# EAGLE schematic ce3_redraw (EAGLE 8.5.1)
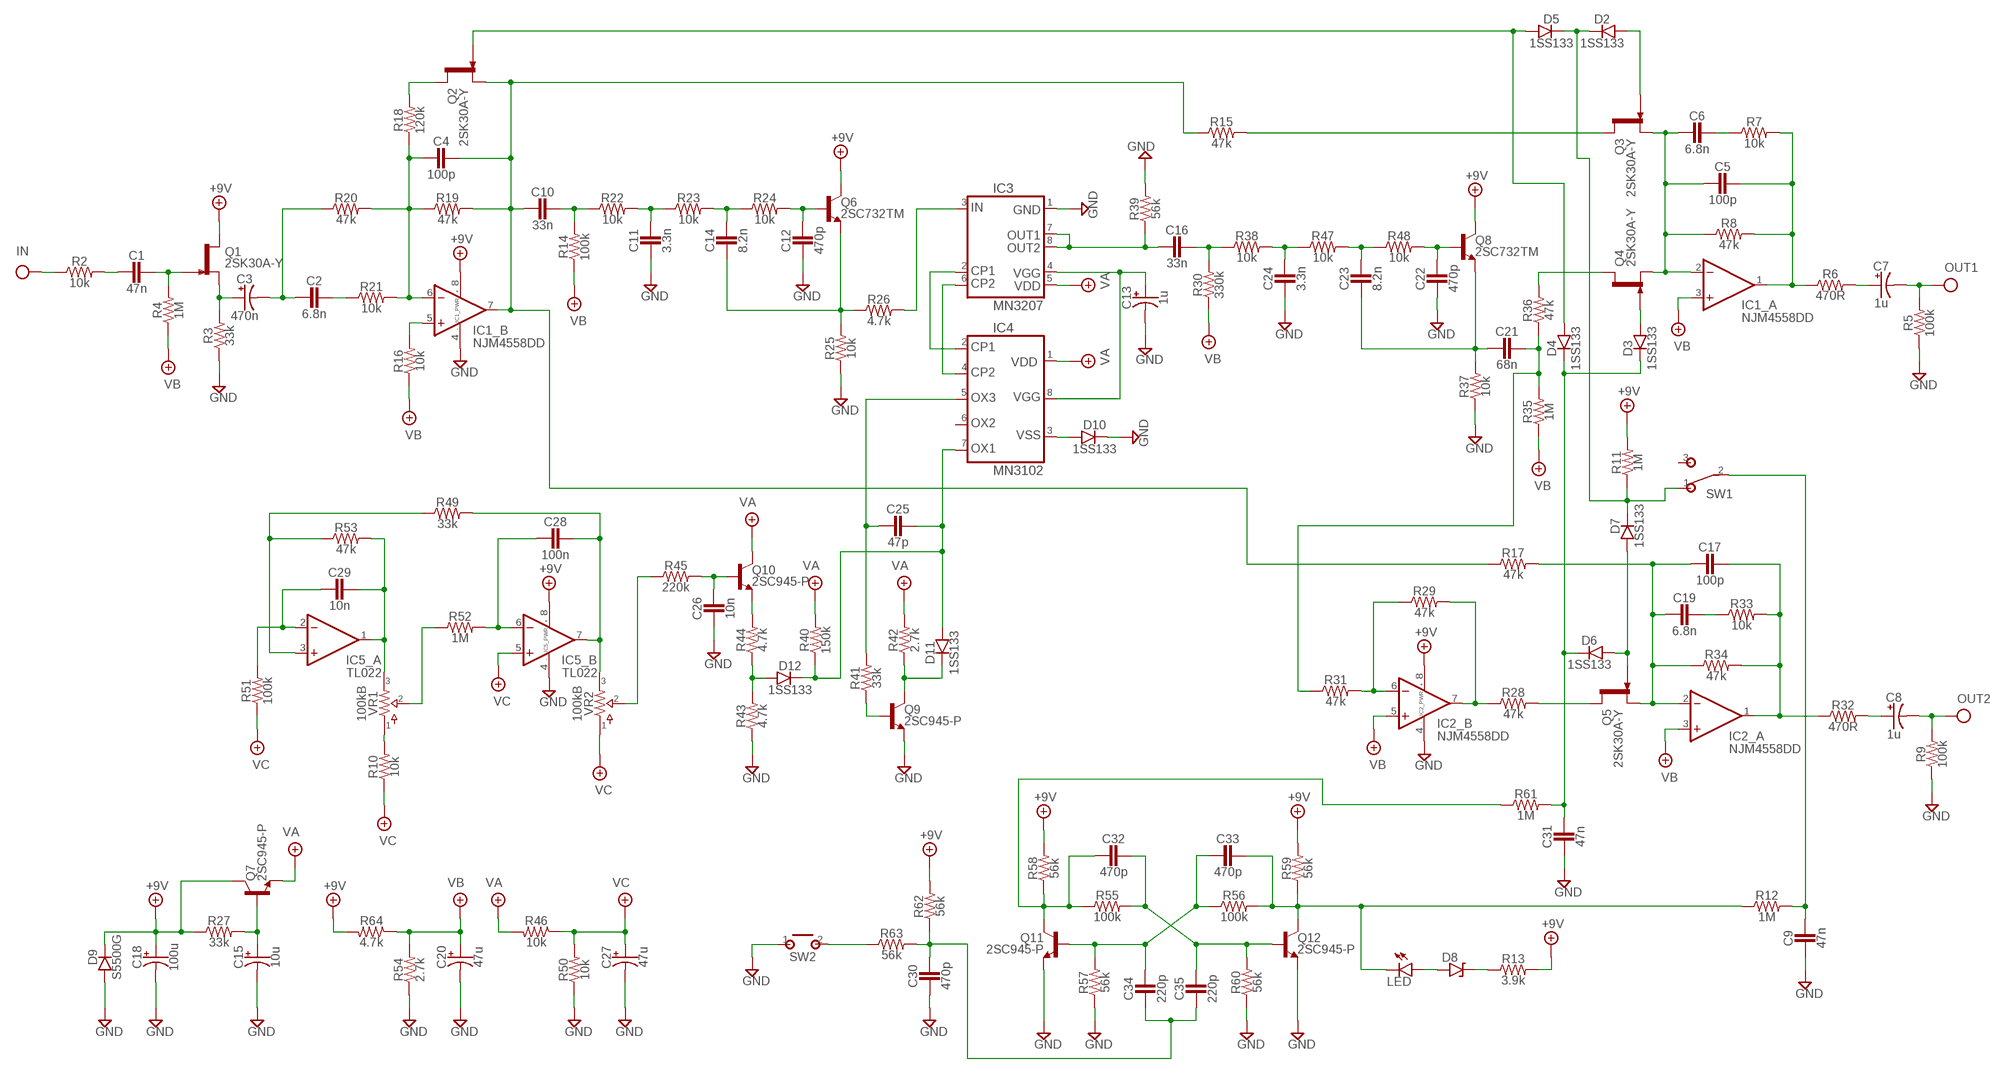
[diagram p0: schematic, sheet 1]

## Parts
C1  47n  CER/FILMBOX.1  [BOX_SMALL]
C2  6.8n  CER/FILMBOX.1  [BOX_SMALL]
C3  470n  0400  [040_020]
C4  100p  CER/FILMBOX.1  [BOX_SMALL]
C5  100p  CER/FILMBOX.1  [BOX_SMALL]
C6  6.8n  CER/FILMBOX.1  [BOX_SMALL]
C7  1u  0400  [040_020]
C8  1u  0400  [040_020]
C9  47n  CER/FILMBOX.1  [BOX_SMALL]
C10  33n  CER/FILMBOX.1  [BOX_SMALL]
C11  3.3n  CER/FILMBOX.1  [BOX_SMALL]
C12  470p  CER/FILMBOX.1  [BOX_SMALL]
C13  1u  0400  [040_020]
C14  8.2n  CER/FILMBOX.1  [BOX_SMALL]
C15  10u  0400  [040_020]
C16  33n  CER/FILMBOX.1  [BOX_SMALL]
C17  100p  CER/FILMBOX.1  [BOX_SMALL]
C18  100u  0400  [040_020]
C19  6.8n  CER/FILMBOX.1  [BOX_SMALL]
C20  47u  0400  [040_020]
C21  68n  CER/FILMBOX.1  [BOX_SMALL]
C22  470p  CER/FILMBOX.1  [BOX_SMALL]
C23  8.2n  CER/FILMBOX.1  [BOX_SMALL]
C24  3.3n  CER/FILMBOX.1  [BOX_SMALL]
C25  47p  CER/FILMBOX.1  [BOX_SMALL]
C26  10n  CER/FILMBOX.1  [BOX_SMALL]
C27  47u  0400  [040_020]
C28  100n  CER/FILMBOX.1  [BOX_SMALL]
C29  10n  CER/FILMBOX.1  [BOX_SMALL]
C30  470p  CER/FILMBOX.1  [BOX_SMALL]
C31  47n  CER/FILMBOX.1  [BOX_SMALL]
C32  470p  CER/FILMBOX.1  [BOX_SMALL]
C33  470p  CER/FILMBOX.1  [BOX_SMALL]
C34  220p  CER/FILMBOX.1  [BOX_SMALL]
C35  220p  CER/FILMBOX.1  [BOX_SMALL]
D2  1SS133  DO35.2  [DO35-2]
D3  1SS133  DO35.2  [DO35-2]
D4  1SS133  DO35.2  [DO35-2]
D5  1SS133  DO35.2  [DO35-2]
D6  1SS133  DO35.2  [DO35-2]
D7  1SS133  DO35.2  [DO35-2]
D8  ZENER.2  [DO41-2]
D9  S5500G  DO35.2  [DO35-2]
D10  1SS133  DO35.2  [DO35-2]
D11  1SS133  DO35.2  [DO35-2]
D12  1SS133  DO35.2  [DO35-2]
IC1  NJM4558DD  DUALTH  [DIL0]
IC2  NJM4558DD  DUALTH  [DIL0]
IC3  MN3207  BL3208  [DIL0]
IC4  MN3102  CLOCK  [DIL8]
IC5  TL022  DUALTH  [DIL0]
LED  LED  [3MM_D]
Q1  2SK30A-Y  2N5457  [TO92-]
Q2  2SK30A-Y  2N5457  [TO92-]
Q3  2SK30A-Y  2N5457  [TO92-]
Q4  2SK30A-Y  2N5457  [TO92-]
Q5  2SK30A-Y  2N5457  [TO92-]
Q6  2SC732TM  2SC828A  [TO92-]
Q7  2SC945-P  2SC828A  [TO92-]
Q8  2SC732TM  2SC828A  [TO92-]
Q9  2SC945-P  2SC828A  [TO92-]
Q10  2SC945-P  2SC828A  [TO92-]
Q11  2SC945-P  2SC828A  [TO92-]
Q12  2SC945-P  2SC828A  [TO92-]
R2  10k  R_.3B  [R0207/3]
R3  33k  R_.3B  [R0207/3]
R4  1M  R_.3B  [R0207/3]
R5  100k  R_.3B  [R0207/3]
R6  470R  R_.3B  [R0207/3]
R7  10k  R_.3B  [R0207/3]
R8  47k  R_.3B  [R0207/3]
R9  100k  R_.3B  [R0207/3]
R10  10k  R_.3B  [R0207/3]
R11  1M  R_.3B  [R0207/3]
R12  1M  R_.3B  [R0207/3]
R13  3.9k  R_.3B  [R0207/3]
R14  100k  R_.3B  [R0207/3]
R15  47k  R_.3B  [R0207/3]
R16  10k  R_.3B  [R0207/3]
R17  47k  R_.3B  [R0207/3]
R18  120k  R_.3B  [R0207/3]
R19  47k  R_.3B  [R0207/3]
R20  47k  R_.3B  [R0207/3]
R21  10k  R_.3B  [R0207/3]
R22  10k  R_.3B  [R0207/3]
R23  10k  R_.3B  [R0207/3]
R24  10k  R_.3B  [R0207/3]
R25  10k  R_.3B  [R0207/3]
R26  4.7k  R_.3B  [R0207/3]
R27  33k  R_.3B  [R0207/3]
R28  47k  R_.3B  [R0207/3]
R29  47k  R_.3B  [R0207/3]
R30  330k  R_.3B  [R0207/3]
R31  47k  R_.3B  [R0207/3]
R32  470R  R_.3B  [R0207/3]
R33  10k  R_.3B  [R0207/3]
R34  47k  R_.3B  [R0207/3]
R35  1M  R_.3B  [R0207/3]
R36  47k  R_.3B  [R0207/3]
R37  10k  R_.3B  [R0207/3]
R38  10k  R_.3B  [R0207/3]
R39  56k  R_.3B  [R0207/3]
R40  150k  R_.3B  [R0207/3]
R41  33k  R_.3B  [R0207/3]
R42  2.7k  R_.3B  [R0207/3]
R43  4.7k  R_.3B  [R0207/3]
R44  4.7k  R_.3B  [R0207/3]
R45  220k  R_.3B  [R0207/3]
R46  10k  R_.3B  [R0207/3]
R47  10k  R_.3B  [R0207/3]
R48  10k  R_.3B  [R0207/3]
R49  33k  R_.3B  [R0207/3]
R50  10k  R_.3B  [R0207/3]
R51  100k  R_.3B  [R0207/3]
R52  1M  R_.3B  [R0207/3]
R53  47k  R_.3B  [R0207/3]
R54  2.7k  R_.3B  [R0207/3]
R55  100k  R_.3B  [R0207/3]
R56  100k  R_.3B  [R0207/3]
R57  56k  R_.3B  [R0207/3]
R58  56k  R_.3B  [R0207/3]
R59  56k  R_.3B  [R0207/3]
R60  56k  R_.3B  [R0207/3]
R61  1M  R_.3B  [R0207/3]
R62  56k  R_.3B  [R0207/3]
R63  56k  R_.3B  [R0207/3]
R64  4.7k  R_.3B  [R0207/3]
SW1  SPDT  [M9040P]
SW2  MOMENTARY  [SPST]
VR1  100kB  POTS16MM  [16MM]
VR2  100kB  POTS16MM  [16MM]

## Nets
+9V: C18.+ D9.C IC1.8(_PWR:V+) IC2.8(_PWR:V+) IC5.8(_PWR:V+) Q1.3(D) Q6.2(C) Q7.2(C) Q8.2(C) R11.2 R13.2 R27.1 R58.2 R59.2 R62.2 R64.2
GND: C9.2 C11.2 C12.2 C13.- C15.- C18.- C20.- C22.2 C24.2 C26.2 C27.- C30.2 C31.2 D9.A D10.C IC1.4(_PWR:V-) IC2.4(_PWR:V-) IC3.1 IC5.4(_PWR:V-) Q9.3(E) Q11.3(E) Q12.3(E) R3.1 R5.1 R9.1 R25.1 R37.1 R39.2 R43.1 R50.1 R54.1 R57.1 R60.1 SW2.1(P)
IN: R2.1
N$1: C15.+ Q7.1(B) R27.2
N$3: C1.2 R2.2
N$4: C1.1 Q1.1(G) R4.2
N$5: C2.2 C3.- R20.1
N$7: C3.+ Q1.2(S) R3.2
N$8: C2.1 R21.1
N$9: C4.2 IC1.6(_B:-IN) R18.1 R19.1 R20.2 R21.2
N$10: IC1.5(_B:+IN) R16.2
N$11: C10.1 R14.2 R22.1
N$12: C4.1 C10.2 IC1.7(_B:OUT) Q2.2(S) R15.1 R17.1 R19.2
N$13: Q2.3(D) R18.2
N$14: C11.1 R22.2 R23.1
N$15: C14.1 R23.2 R24.1
N$16: C14.2 Q6.3(E) R25.2 R26.1
N$17: C12.1 Q6.1(B) R24.2
N$18: C13.+ IC3.4 IC4.8
N$19: D11.C Q9.2(C) R42.1
N$20: D10.A IC4.3
N$21: C25.2 IC4.5 R41.2
N$22: Q9.1(B) R41.1
N$23: C16.2 IC3.7 IC3.8 R39.1
N$24: D12.A R43.2 R44.1
N$25: IC3.3 R26.2
N$26: IC3.2 IC4.2
N$29: C32.2 Q11.2(C) R55.1 R58.1 R61.1
N$30: C29.2 IC5.2(_A:-IN) R51.2
N$31: C7.+ R6.2
N$32: C33.2 C34.1 Q11.1(B) R56.1 R57.2
N$33: IC3.6 IC4.4
N$34: C32.1 C35.1 Q12.1(B) R55.2 R60.2
N$35: C29.1 IC5.1(_A:OUT) R53.2 VR1.3
N$36: IC5.3(_A:+IN) R49.1 R53.1
N$37: C16.1 R30.2 R38.1
N$38: R10.2 VR1.1
N$39: R52.1 VR1.2
N$40: C28.2 IC5.6(_B:-IN) R52.2
N$42: C28.1 IC5.7(_B:OUT) R49.2 VR2.3
N$43: C24.1 R38.2 R47.1
N$44: R45.1 VR2.2
N$45: C26.1 Q10.1(B) R45.2
N$46: C30.1 C34.2 C35.2 R62.1 R63.2
N$47: Q10.3(E) R44.2
N$48: C23.1 R47.2 R48.1
N$49: C22.1 Q8.1(B) R48.2
N$50: C21.2 C23.2 Q8.3(E) R37.2
N$51: C5.2 C6.2 IC1.2(_A:-IN) Q3.2(S) Q4.2(S) R8.1
N$52: C21.1 R31.1 R35.2 R36.1
N$53: C5.1 IC1.1(_A:OUT) R6.1 R7.2 R8.2
N$54: C6.1 R7.1
N$55: Q4.3(D) R36.2
N$56: Q3.3(D) R15.2
N$57: D2.A Q3.1(G)
N$58: D2.C D5.C D7.C R11.1 SW1.1(O)
N$59: D4.A D5.A Q2.1(G)
N$60: D3.A Q4.1(G)
N$61: C31.1 D3.C D4.C D6.C R61.2
N$62: C17.2 C19.2 IC2.2(_A:-IN) Q5.2(S) R17.2 R34.1
N$63: C17.1 IC2.1(_A:OUT) R32.1 R33.2 R34.2
N$64: C8.+ R32.2
N$65: C19.1 R33.1
N$66: D6.A D7.A Q5.1(G)
N$67: Q5.3(D) R28.2
N$68: IC2.7(_B:OUT) R28.1 R29.2
N$69: IC2.6(_B:-IN) R29.1 R31.2
N$70: C25.1 D11.A D12.C IC4.7 R40.1
N$72: D8.C R13.1
N$74: C9.1 R12.2 SW1.2(P)
N$75: C33.1 LED.P$1(C) Q12.2(C) R12.1 R56.2 R59.1
N$76: D8.A LED.ANODE(A)
N$77: R63.1 SW2.2(S)
OUT: C7.- C8.- R5.2 R9.2
VA: IC3.5 IC4.1 Q7.3(E) Q10.2(C) R40.2 R42.2 R46.2
VB: C20.+ IC1.3(_A:+IN) IC2.3(_A:+IN) IC2.5(_B:+IN) R4.1 R14.1 R16.1 R30.1 R35.1 R54.2 R64.1
VC: C27.+ IC5.5(_B:+IN) R10.1 R46.1 R50.2 R51.1 VR2.1
Unconnected: IC4.6 SW1.3(S)

## Library data of the parts
C1 C2 C4-C6 C9-C12 C14 C16 C17 C19 C21-C26 C28-C35 = pedals-capacitors-film:CER/FILM: 47 - 120pF Xicon Ceramic Disc 2.5mm lead spacing
C3 C7 C8 C13 C15 C18 C20 C27 = pedals-capacitors-elec:040
D2-D7 D9-D12 = pedals-diodes:DO35: DO-35 Package Diodes: 1N914
D8 = pedals-diodes:ZENER
IC1 IC2 IC5 = pedals-integrated circuits:DUAL: OP AMP
IC3 = pedals-integrated circuits:BL3208
IC4 = pedals-integrated circuits:CLOCK
LED = pedals-diodes:LED
Q1-Q5 = pedals-transistors:2N5457: N-CHANNEL JFET
Q6-Q12 = pedals-transistors:2SC828A
R2-R64 = pedals-resistors:R_
SW1 = pedals-switches:SPDT: TOGGLE SWITCH Marquardt
SW2 = pedals-switches:MOMENTARY
VR1 VR2 = pedals-potentiometers:POTS